# EAGLE design vectrex_rom_27c1001_1_pcb (EAGLE 9.6.2)
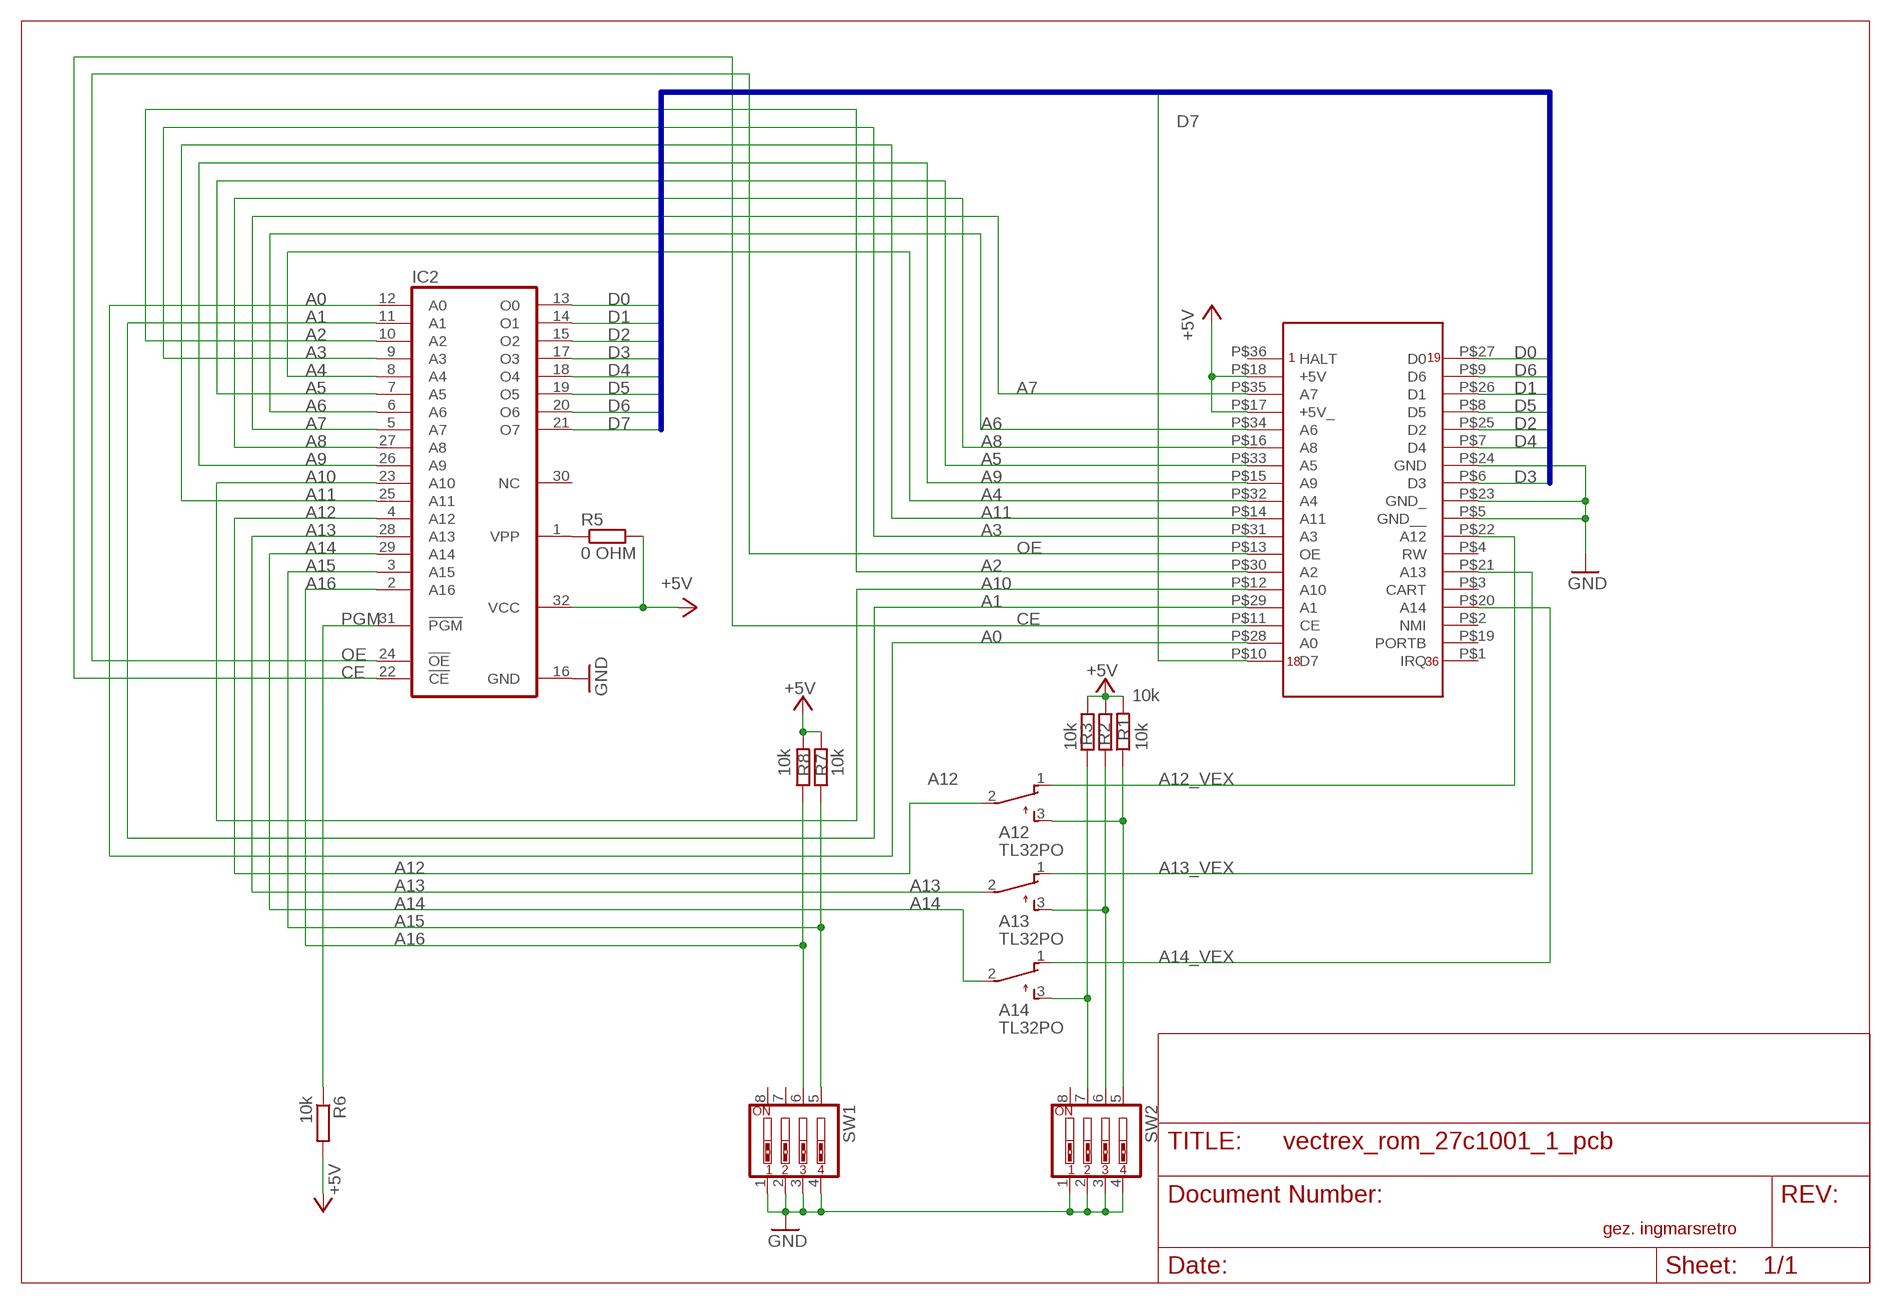
[diagram p0: schematic, sheet 1]

## Parts
A12  TL32PO  [TL3XPO]
A13  TL32PO  [TL3XPO]
A14  TL32PO  [TL3XPO]
IC2  27C1001A  [DIL32]
R1  10k  R-EU_R0805  [R0805]
R2  10k  R-EU_R0805  [R0805]
R3  10k  R-EU_R0805  [R0805]
R5  0 OHM  R-EU_R0805  [R0805]
R6  10k  R-EU_R0805  [R0805]
R7  10k  R-EU_R0805  [R0805]
R8  10k  R-EU_R0805  [R0805]
SW1  SW_DIP-4  [EDG-04]
SW2  SW_DIP-4  [EDG-04]
U$1  VECTREX_ROMCONNECTOR  [ROM_CONNECTOR_PCB]

## Nets
+5V: IC2.32(VCC) R1.2 R2.1 R3.1 R5.2 R6.2 R7.2 R8.2 U$1.P$17(+5V_) U$1.P$18(+5V)
A0: IC2.12(A0) U$1.P$28(A0)
A1: IC2.11(A1) U$1.P$29(A1)
A2: IC2.10(A2) U$1.P$30(A2)
A3: IC2.9(A3) U$1.P$31(A3)
A4: IC2.8(A4) U$1.P$32(A4)
A5: IC2.7(A5) U$1.P$33(A5)
A6: IC2.6(A6) U$1.P$34(A6)
A7: IC2.5(A7) U$1.P$35(A7)
A8: IC2.27(A8) U$1.P$16(A8)
A9: IC2.26(A9) U$1.P$15(A9)
A10: IC2.23(A10) U$1.P$12(A10)
A11: IC2.25(A11) U$1.P$14(A11)
A12: A12.2(P) IC2.4(A12)
A12_VEX: A12.1(O) U$1.P$22(A12)
A13: A13.2(P) IC2.28(A13)
A13_VEX: A13.1(O) U$1.P$21(A13)
A14: A14.2(P) IC2.29(A14)
A14_VEX: A14.1(O) U$1.P$20(A14)
A15: IC2.3(A15) R7.1 SW1.5
A16: IC2.2(A16) R8.1 SW1.6
CE: IC2.22(!CE) U$1.P$11(CE)
D0: IC2.13(O0) U$1.P$27(D0)
D1: IC2.14(O1) U$1.P$26(D1)
D2: IC2.15(O2) U$1.P$25(D2)
D3: IC2.17(O3) U$1.P$6(D3)
D4: IC2.18(O4) U$1.P$7(D4)
D5: IC2.19(O5) U$1.P$8(D5)
D6: IC2.20(O6) U$1.P$9(D6)
D7: IC2.21(O7) U$1.P$10(D7)
GND: IC2.16(GND) SW1.1 SW1.2 SW1.3 SW1.4 SW2.1 SW2.2 SW2.3 SW2.4 U$1.P$5(GND__) U$1.P$23(GND_) U$1.P$24(GND)
N$1: A12.3(S) R1.1 SW2.5
N$2: A13.3(S) R2.2 SW2.6
N$3: A14.3(S) R3.2 SW2.7
N$4: IC2.1(VPP) R5.1
OE: IC2.24(!OE) U$1.P$13(OE)
PGM: IC2.31(!PGM) R6.1
Unconnected: IC2.30(NC) SW1.7 SW1.8 SW2.8 U$1.P$1(IRQ) U$1.P$2(NMI) U$1.P$3(CART) U$1.P$4(RW) U$1.P$19(PORTB) U$1.P$36(HALT)

## Buses
D0,D1,D2,D3,D4,D5,D6,D7

## Notes on the sheet
- gez. ingmarsretro

## Library data of the parts
A12-A14 = switch:TL32PO: TINY SWITCH ON - MOM Source: http://www2.produktinfo.conrad.com/datenblaetter/700000-724999/705152-da-01-de-Subminiaturschalter_TL_36YO.pdf
IC2 = memory-nec:27C1001A: MEMORY; MPN: M27C1001-15F1; OC_FARNELL: 1661756; OC_NEWARK: 78M7615
R1-R3 R5-R8 = rcl:R-EU_: RESISTOR, European symbol; SPICEPREFIX: R
SW1 SW2 = special:SW_DIP-4: DIP SWITCH
U$1 = vectrex_rom:VECTREX_ROMCONNECTOR

## Board
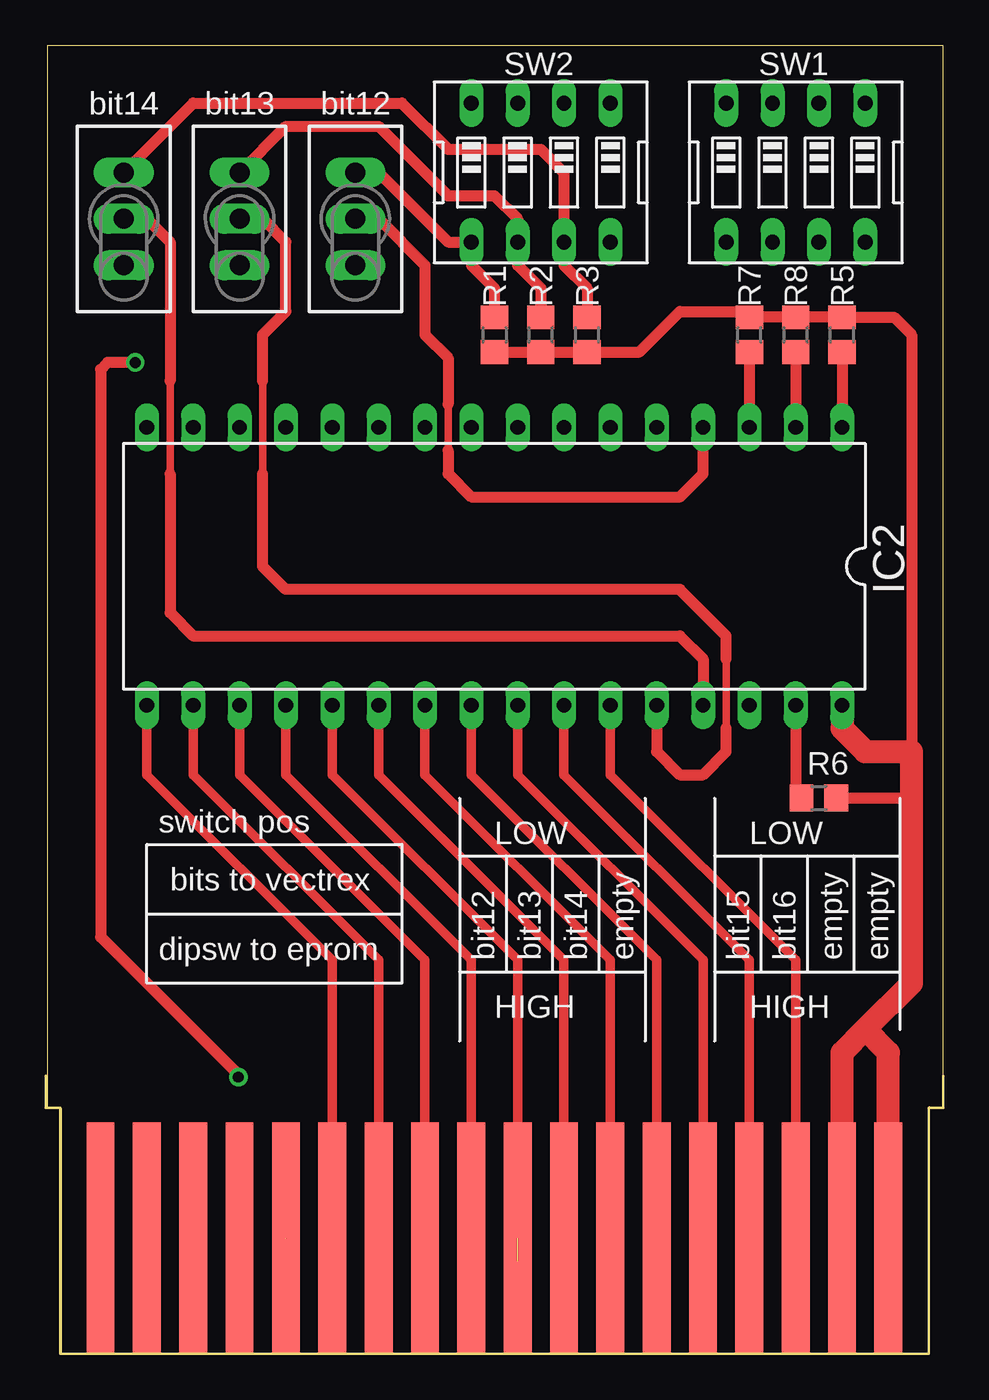
[diagram p1: board, top side]
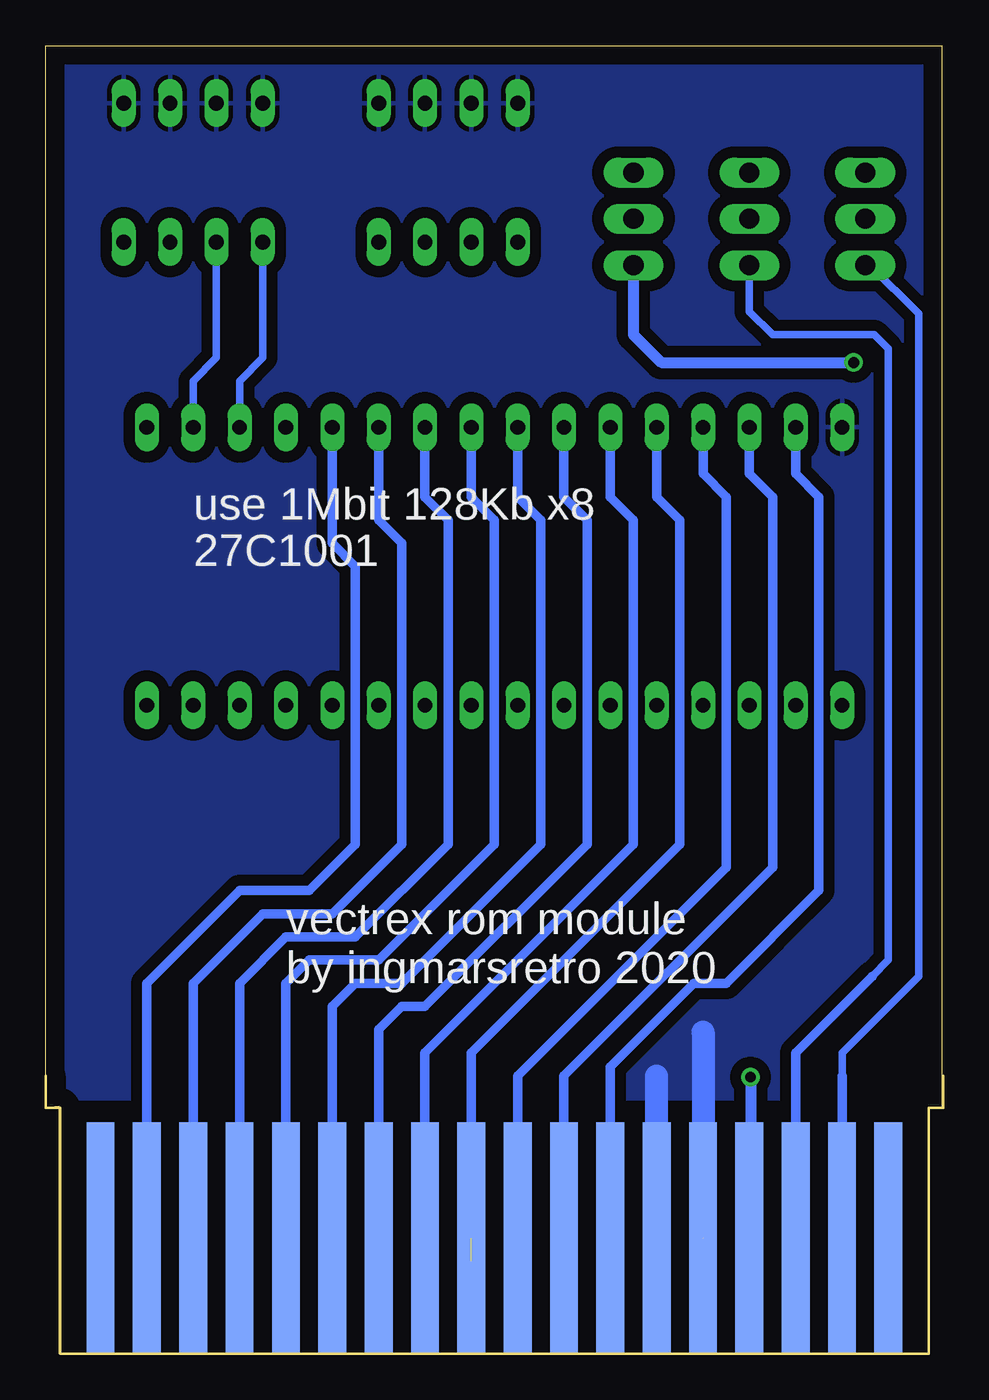
[diagram p2: board, bottom side, seen from below]

Size 49.12 x 71.73 mm. Coordinates in mm from the lower left corner, seen from the top.
Outline: 0.77,0 48.38,0 48.38,13.57 49.12,13.49 49.12,71.73 0,71.73 0,13.49 0.77,13.46 0.77,0
Copper layers (1*16): Top 0.035mm / dielectric 1.5mm / Bottom 0.035mm
Design rules "default": minimum track width 6mil, minimum drill 0.35mm, track to track 6mil, track to pad 6mil, pad to pad 6mil, via to via 6mil, smd to smd 6mil, copper to edge 40mil, drill to drill 6mil, minimum pad ring 10mil, minimum via ring 8mil, stop-mask expansion 4mil, vias tented up to drill 0mil, thermal gap 10mil

### Footprints (pad centres in the part's own frame; a part is rotated, then mirrored left to right if it is on the bottom)
TL3XPO = drill 1.1 pad 1.422 long: 1 -2.54,0; 2 0,0; 3 2.54,0
DIL32 = drill 0.813 long: 1 -19.05,-7.62; 2 -16.51,-7.62; 3 -13.97,-7.62; 4 -11.43,-7.62; 5 -8.89,-7.62; 6 -6.35,-7.62; 7 -3.81,-7.62; 8 -1.27,-7.62; 9 1.27,-7.62; 10 3.81,-7.62; 11 6.35,-7.62; 12 8.89,-7.62; 13 11.43,-7.62; 14 13.97,-7.62; 15 16.51,-7.62; 16 19.05,-7.62; 17 19.05,7.62; 18 16.51,7.62; 19 13.97,7.62; 20 11.43,7.62; 21 8.89,7.62; 22 6.35,7.62; 23 3.81,7.62; 24 1.27,7.62; 25 -1.27,7.62; 26 -3.81,7.62; 27 -6.35,7.62; 28 -8.89,7.62; 29 -11.43,7.62; 30 -13.97,7.62; 31 -16.51,7.62; 32 -19.05,7.62
R0805 = smd 1.3 x 1.5: 1 -0.95,0; 2 0.95,0
EDG-04 = drill 0.813 long: 1 -3.81,-3.81; 2 -1.27,-3.81; 3 1.27,-3.81; 4 3.81,-3.81; 5 3.81,3.81; 6 1.27,3.81; 7 -1.27,3.81; 8 -3.81,3.81
ROM_CONNECTOR_PCB = smd 1.524 x 12.7: P$1 -21.59,6.35; P$2 -19.05,6.35; P$3 -16.51,6.35; P$4 -13.97,6.35; P$5 -11.43,6.35; P$6 -8.89,6.35; P$7 -6.35,6.35; P$8 -3.81,6.35; P$9 -1.27,6.35; P$10 1.27,6.35; P$11 3.81,6.35; P$12 6.35,6.35; P$13 8.89,6.35; P$14 11.43,6.35; P$15 13.97,6.35; P$16 16.51,6.35; P$17 19.05,6.35; P$18 21.59,6.35 | smd 1.524 x 12.7 bottom: P$19 -21.59,6.35; P$20 -19.05,6.35; P$21 -16.51,6.35; P$22 -13.97,6.35; P$23 -11.43,6.35; P$24 -8.89,6.35; P$25 -6.35,6.35; P$26 -3.81,6.35; P$27 -1.27,6.35; P$28 1.27,6.35; P$29 3.81,6.35; P$30 6.35,6.35; P$31 8.89,6.35; P$32 11.43,6.35; P$33 13.97,6.35; P$34 16.51,6.35; P$35 19.05,6.35; P$36 21.59,6.35

### Placement (x,y rotation side)
A12  16.9,62.23 90 top
A13  10.55,62.23 90 top
A14  4.2,62.23 90 top
IC2  24.52,43.18 180 top
R1  24.52,55.88 270 top
R2  27.06,55.88 90 top
R3  29.6,55.88 90 top
R5  43.57,55.88 90 top
R6  42.3,30.48 0 top
R7  38.49,55.88 90 top
R8  41.03,55.88 90 top
SW1  41.03,64.77 180 top
SW2  27.06,64.77 180 top
U$1  24.52,0 0 top

### Tracks (layer width: path | path; a pad name or v marks a point on that pad's centre or on a via)
+5V
  Top 0.508: U$1.P$17 43.57,7.62
  Top 0.61: R6.2 47.38,30.48 | R1.2 R2.1 R3.1 32.46,54.93 34.68,57.15 38.17,57.15 R7.2 R8.2 R5.2 46.43,56.83 47.38,55.88 47.38,33.02
  Top 1.27: U$1.P$18 46.11,16.51 44.84,17.78 | 44.84,17.78 43.57,16.51 43.57,7.62 | 44.84,17.78 47.38,20.32 47.38,30.48 47.38,33.02 44.84,33.02 43.57,34.29 IC2.32
A0
  Bottom 0.508: IC2.12 15.63,46.99 14.36,45.72 14.36,27.94 25.79,16.51 U$1.P$28
A1
  Bottom 0.508: IC2.11 18.17,46.99 16.9,45.72 16.9,27.94 28.33,16.51 U$1.P$29
A2
  Bottom 0.508: IC2.10 20.71,46.99 19.44,45.72 19.44,27.94 28.33,19.05 29.6,19.05 30.87,17.78 U$1.P$30 30.87,5.08
A3
  Bottom 0.508: IC2.9 23.25,46.99 21.98,45.72 21.98,27.94 29.6,20.32 32.14,20.32 33.41,19.05 U$1.P$31 33.41,3.81
A4
  Bottom 0.508: U$1.P$32 35.95,20.32 34.68,21.59 30.87,21.59 24.52,27.94 24.52,45.72 25.79,46.99 IC2.8 | U$1.P$32 35.95,2.54 | 35.95,5.08 U$1.P$32
A5
  Bottom 0.508: IC2.7 28.33,46.99 27.06,45.72 27.06,27.94 32.14,22.86 35.95,22.86 38.49,20.32 U$1.P$33
A6
  Bottom 0.508: U$1.P$34 41.03,20.32 37.22,24.13 33.41,24.13 29.6,27.94 29.6,44.45 30.87,45.72 IC2.6
A7
  Bottom 0.508: IC2.5 33.41,44.45 32.14,43.18 32.14,27.94 34.68,25.4 38.49,25.4 43.57,20.32 U$1.P$35
A8
  Top 0.508: U$1.P$16 41.03,21.59 30.87,31.75 IC2.27
A9
  Top 0.508: IC2.26 28.33,31.75 38.49,21.59 U$1.P$15
A10
  Top 0.508: IC2.23 20.71,31.75 30.87,21.59 U$1.P$12
A11
  Top 0.508: U$1.P$14 35.95,21.59 25.79,31.75 IC2.25
A12
  Top 0.406: 21.98,52.07 21.98,49.53
  Top 0.61: A12.2 18.17,62.23 20.71,59.69 20.71,55.88 21.98,54.61 21.98,52.07 | 21.98,49.53 21.98,48.26 23.25,46.99 34.68,46.99 35.95,48.26 IC2.4
A12_VEX  (via drill 0.6)
  Top 0.61: v4.83,54.36 3.31,54.36 2.93,53.97 2.93,22.86 10.55,15.24 v10.49,15.18
  Bottom 0.61: A12.1 16.9,55.88 15.38,54.36 v4.83,54.36 | v10.49,15.18 10.49,7.68 10.55,7.62 U$1.P$22
A13
  Top 0.406: 37.22,34.29 37.22,38.1 | 11.82,48.26 11.82,53.34
  Top 0.61: IC2.28 33.41,33.02 34.68,31.75 35.95,31.75 37.22,33.02 37.22,34.29 | 37.22,38.1 37.22,39.37 34.68,41.91 13.09,41.91 11.82,43.18 11.82,48.26 | 11.82,53.34 11.82,55.88 13.09,57.15 13.09,60.96 11.82,62.23 A13.2
A13_VEX
  Bottom 0.406: 3.82,20.7 2.93,21.59 2.93,55.12 3.69,55.88 9.28,55.88 10.55,57.15 A13.1
  Bottom 0.508: 3.82,20.7 8.01,16.51 U$1.P$21
A14
  Top 0.406: 6.74,53.34 6.74,48.26
  Top 0.61: A14.2 5.47,62.23 6.74,60.96 6.74,53.34 | IC2.29 35.95,38.1 34.68,39.37 8.01,39.37 6.74,40.64 6.74,48.26
A14_VEX
  Bottom 0.406: A14.1 3.95,59.69 1.28,57.02 1.28,20.7 5.47,16.51 5.47,15.24
  Bottom 0.508: U$1.P$20 5.47,15.24
A15
  Top 0.61: R7.1 IC2.3
  Bottom 0.406: SW1.5 37.22,54.61 38.49,53.34 IC2.3
A16
  Top 0.61: R8.1 IC2.2
  Bottom 0.406: IC2.2 41.03,53.34 39.76,54.61 SW1.6
CE
  Top 0.508: IC2.22 18.17,31.75 28.33,21.59 U$1.P$11
D0
  Bottom 0.508: IC2.13 13.09,48.26 11.82,46.99 11.82,26.67 23.25,15.24 U$1.P$27
D1
  Bottom 0.508: IC2.14 10.55,48.26 9.28,46.99 9.28,26.67 20.71,15.24 U$1.P$26
D2
  Bottom 0.508: IC2.15 8.01,48.26 6.74,46.99 6.74,25.4 11.82,20.32 13.6,20.32 18.17,15.75 U$1.P$25
D3
  Top 0.508: U$1.P$6 15.63,21.59 5.47,31.75 IC2.17
D4
  Top 0.508: IC2.18 8.01,31.75 18.17,21.59 U$1.P$7
D5
  Top 0.508: IC2.19 10.55,31.75 20.71,21.59 U$1.P$8
D6
  Top 0.508: IC2.20 13.09,31.75 23.25,21.59 U$1.P$9
D7  (1 unrouted)
  Top 0.508: IC2.21 15.63,31.75 25.79,21.59 25.79,5.08
GND  (1 unrouted)
  Bottom 1.27: U$1.P$24 15.63,15.24 | 13.09,17.65 U$1.P$23
  pour Bottom (isolate 0.61): 0.39,13.97 0.39,71.76 48.4,71.76 48.4,13.97
N$1
  Top 0.61: R1.1 24.52,58.42 23.25,59.69 SW2.5 21.98,60.96 18.17,64.77 A12.3
N$2
  Top 0.61: R2.2 27.06,58.42 25.79,59.69 SW2.6 25.79,62.23 24.52,63.5 21.98,63.5 18.17,67.31 13.09,67.31 A13.3
N$3
  Top 0.61: R3.2 29.6,58.42 28.33,59.69 SW2.7 28.33,64.77 27.06,66.04 21.98,66.04 19.44,68.58 8.01,68.58 A14.3
N$4
  Top 0.61: R5.1 IC2.1
OE
  Top 0.508: IC2.24 23.25,31.75 33.41,21.59 U$1.P$13
PGM
  Top 0.61: R6.1 41.03,30.8 IC2.31

### Text on the board
tNames: bit14 | bit13 | bit12 | switch pos | LOW | LOW | bits to vectrex | dipsw to eprom | bit12 | bit13 | bit14 | empty | bit15 | bit16 | empty | empty | HIGH | HIGH
bNames: use 1Mbit 128Kb x8 | 27C1001 | vectrex rom module / by ingmarsretro 2020